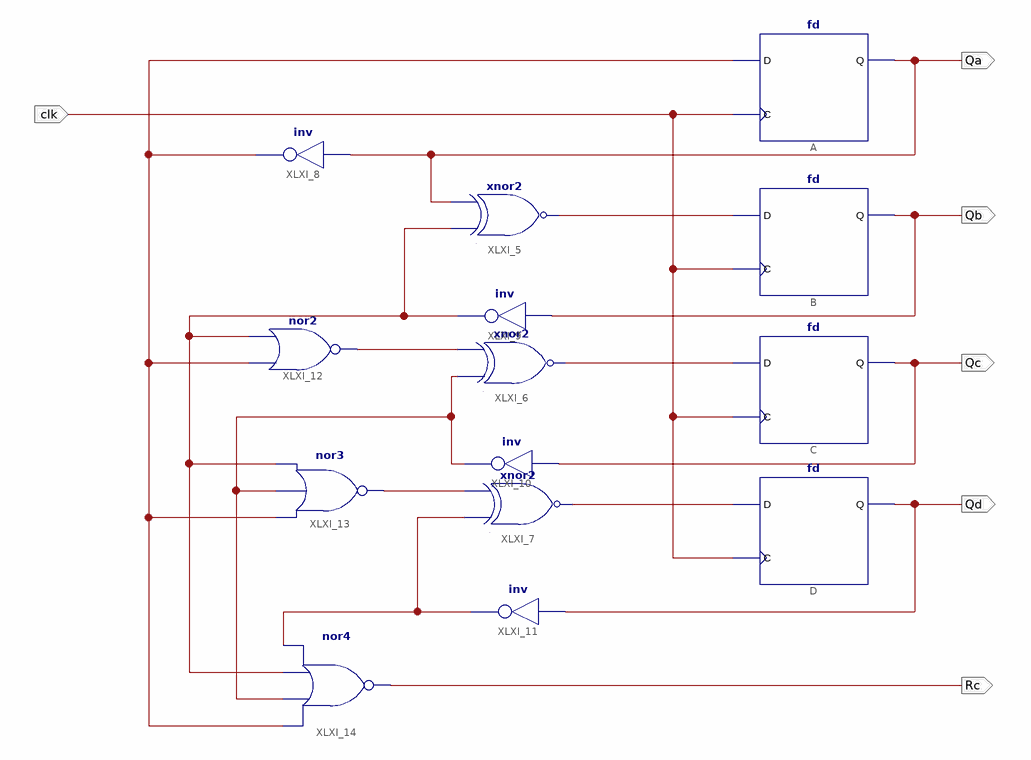
[diagram p0: schematic sheet 1]
// Xilinx ISE schematic Counter_4bit.sch (kintex7) as structural Verilog: 14 symbols, 6 ports
module Counter_4bit (
  input  clk,
  output Qa,
  output Qb,
  output Qc,
  output Qd,
  output Rc
);

  wire XLXN_7, XLXN_8, XLXN_9, XLXN_12, XLXN_13, XLXN_16, XLXN_21, XLXN_22, XLXN_24;

  fd A (.C(clk), .D(XLXN_21), .Q(Qa));
  fd B (.C(clk), .D(XLXN_9), .Q(Qb));
  fd C (.C(clk), .D(XLXN_8), .Q(Qc));
  fd D (.C(clk), .D(XLXN_7), .Q(Qd));
  xnor XLXI_5 (XLXN_9, XLXN_22, Qa);
  xnor XLXI_6 (XLXN_8, XLXN_24, XLXN_13);
  xnor XLXI_7 (XLXN_7, XLXN_16, XLXN_12);
  not XLXI_8 (XLXN_21, Qa);
  not XLXI_9 (XLXN_22, Qb);
  not XLXI_10 (XLXN_24, Qc);
  not XLXI_11 (XLXN_16, Qd);
  nor XLXI_12 (XLXN_13, XLXN_21, XLXN_22);
  nor XLXI_13 (XLXN_12, XLXN_21, XLXN_24, XLXN_22);
  nor XLXI_14 (Rc, XLXN_21, XLXN_24, XLXN_22, XLXN_16);
endmodule
